# Altium project Board Gate Logic.PrjPcb
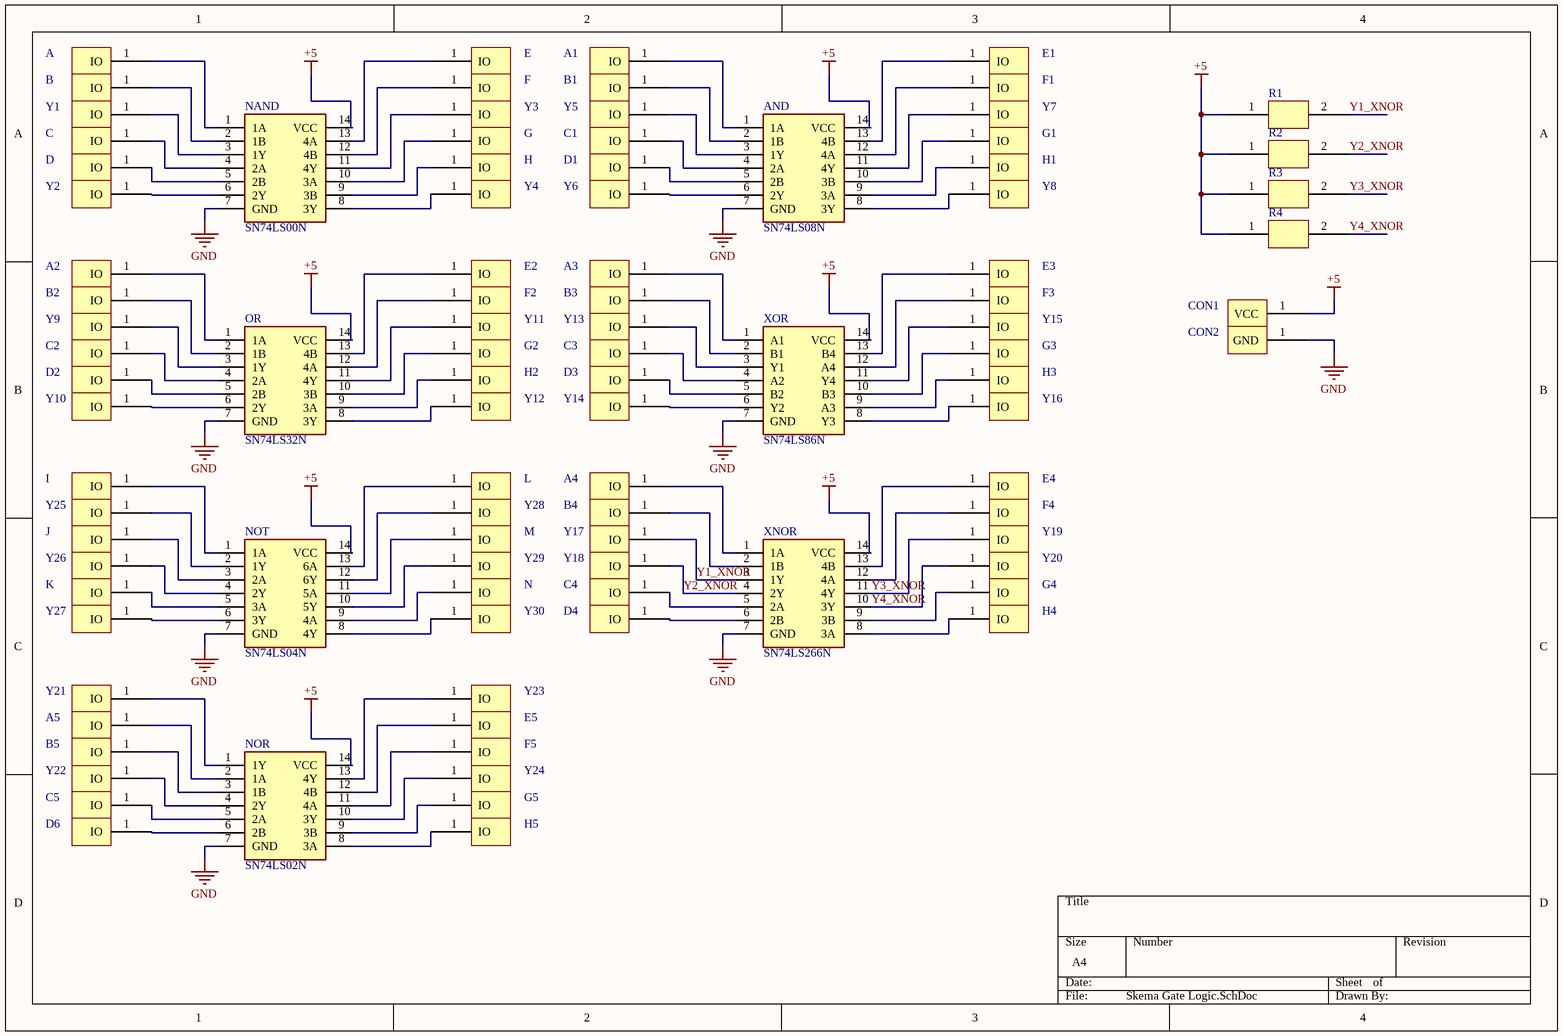
[diagram p0: Skema Gate Logic.SchDoc]
1 sheet, 97 parts. Net scope: global (net labels, ports and power ports of the same name join across sheets).
Board file: PCB Gate Logic.PcbDoc

## Sheet Skema Gate Logic.SchDoc
size A4

### Parts
A  Female_Connector_Banana  [F_Banana]  (value not drawn)
A1  Female_Connector_Banana  [F_Banana]  (value not drawn)
A2  Female_Connector_Banana  [F_Banana]  (value not drawn)
A3  Female_Connector_Banana  [F_Banana]  (value not drawn)
A4  Female_Connector_Banana  [F_Banana]  (value not drawn)
A5  Female_Connector_Banana  [F_Banana]  (value not drawn)
AND  SN74LS08N  [DIP794W53P254L1930H508Q14N]
B  Female_Connector_Banana  [F_Banana]  (value not drawn)
B1  Female_Connector_Banana  [F_Banana]  (value not drawn)
B2  Female_Connector_Banana  [F_Banana]  (value not drawn)
B3  Female_Connector_Banana  [F_Banana]  (value not drawn)
B4  Female_Connector_Banana  [F_Banana]  (value not drawn)
B5  Female_Connector_Banana  [F_Banana]  (value not drawn)
C  Female_Connector_Banana  [F_Banana]  (value not drawn)
C1  Female_Connector_Banana  [F_Banana]  (value not drawn)
C2  Female_Connector_Banana  [F_Banana]  (value not drawn)
C3  Female_Connector_Banana  [F_Banana]  (value not drawn)
C4  Female_Connector_Banana  [F_Banana]  (value not drawn)
C5  Female_Connector_Banana  [F_Banana]  (value not drawn)
CON1  Female_Connector_Banana  [F_Banana]  (value not drawn)
CON2  Female_Connector_Banana  [F_Banana]  (value not drawn)
D  Female_Connector_Banana  [F_Banana]  (value not drawn)
D1  Female_Connector_Banana  [F_Banana]  (value not drawn)
D2  Female_Connector_Banana  [F_Banana]  (value not drawn)
D3  Female_Connector_Banana  [F_Banana]  (value not drawn)
D4  Female_Connector_Banana  [F_Banana]  (value not drawn)
D6  Female_Connector_Banana  [F_Banana]  (value not drawn)
E  Female_Connector_Banana  [F_Banana]  (value not drawn)
E1  Female_Connector_Banana  [F_Banana]  (value not drawn)
E2  Female_Connector_Banana  [F_Banana]  (value not drawn)
E3  Female_Connector_Banana  [F_Banana]  (value not drawn)
E4  Female_Connector_Banana  [F_Banana]  (value not drawn)
E5  Female_Connector_Banana  [F_Banana]  (value not drawn)
F  Female_Connector_Banana  [F_Banana]  (value not drawn)
F1  Female_Connector_Banana  [F_Banana]  (value not drawn)
F2  Female_Connector_Banana  [F_Banana]  (value not drawn)
F3  Female_Connector_Banana  [F_Banana]  (value not drawn)
F4  Female_Connector_Banana  [F_Banana]  (value not drawn)
F5  Female_Connector_Banana  [F_Banana]  (value not drawn)
G  Female_Connector_Banana  [F_Banana]  (value not drawn)
G1  Female_Connector_Banana  [F_Banana]  (value not drawn)
G2  Female_Connector_Banana  [F_Banana]  (value not drawn)
G3  Female_Connector_Banana  [F_Banana]  (value not drawn)
G4  Female_Connector_Banana  [F_Banana]  (value not drawn)
G5  Female_Connector_Banana  [F_Banana]  (value not drawn)
H  Female_Connector_Banana  [F_Banana]  (value not drawn)
H1  Female_Connector_Banana  [F_Banana]  (value not drawn)
H2  Female_Connector_Banana  [F_Banana]  (value not drawn)
H3  Female_Connector_Banana  [F_Banana]  (value not drawn)
H4  Female_Connector_Banana  [F_Banana]  (value not drawn)
H5  Female_Connector_Banana  [F_Banana]  (value not drawn)
I  Female_Connector_Banana  [F_Banana]  (value not drawn)
J  Female_Connector_Banana  [F_Banana]  (value not drawn)
K  Female_Connector_Banana  [F_Banana]  (value not drawn)
L  Female_Connector_Banana  [F_Banana]  (value not drawn)
M  Female_Connector_Banana  [F_Banana]  (value not drawn)
N  Female_Connector_Banana  [F_Banana]  (value not drawn)
NAND  SN74LS00N  [DIP794W53P254L1930H508Q14N]
NOR  SN74LS02N  [DIP794W53P254L1930H508Q14N]
NOT  SN74LS04N  [DIP794W53P254L1930H508Q14N]
OR  SN74LS32N  [DIP794W53P254L1930H508Q14N]
R1  Resistor  [Resistor]  (value not drawn)
R2  Resistor  [Resistor]  (value not drawn)
R3  Resistor  [Resistor]  (value not drawn)
R4  Resistor  [Resistor]  (value not drawn)
XNOR  SN74LS266N  [DIP794W53P254L1930H508Q14N]
XOR  SN74LS86N  [DIP794W53P254L1930H508Q14N]
Y1  Female_Connector_Banana  [F_Banana]  (value not drawn)
Y2  Female_Connector_Banana  [F_Banana]  (value not drawn)
Y3  Female_Connector_Banana  [F_Banana]  (value not drawn)
Y4  Female_Connector_Banana  [F_Banana]  (value not drawn)
Y5  Female_Connector_Banana  [F_Banana]  (value not drawn)
Y6  Female_Connector_Banana  [F_Banana]  (value not drawn)
Y7  Female_Connector_Banana  [F_Banana]  (value not drawn)
Y8  Female_Connector_Banana  [F_Banana]  (value not drawn)
Y9  Female_Connector_Banana  [F_Banana]  (value not drawn)
Y10  Female_Connector_Banana  [F_Banana]  (value not drawn)
Y11  Female_Connector_Banana  [F_Banana]  (value not drawn)
Y12  Female_Connector_Banana  [F_Banana]  (value not drawn)
Y13  Female_Connector_Banana  [F_Banana]  (value not drawn)
Y14  Female_Connector_Banana  [F_Banana]  (value not drawn)
Y15  Female_Connector_Banana  [F_Banana]  (value not drawn)
Y16  Female_Connector_Banana  [F_Banana]  (value not drawn)
Y17  Female_Connector_Banana  [F_Banana]  (value not drawn)
Y18  Female_Connector_Banana  [F_Banana]  (value not drawn)
Y19  Female_Connector_Banana  [F_Banana]  (value not drawn)
Y20  Female_Connector_Banana  [F_Banana]  (value not drawn)
Y21  Female_Connector_Banana  [F_Banana]  (value not drawn)
Y22  Female_Connector_Banana  [F_Banana]  (value not drawn)
Y23  Female_Connector_Banana  [F_Banana]  (value not drawn)
Y24  Female_Connector_Banana  [F_Banana]  (value not drawn)
Y25  Female_Connector_Banana  [F_Banana]  (value not drawn)
Y26  Female_Connector_Banana  [F_Banana]  (value not drawn)
Y27  Female_Connector_Banana  [F_Banana]  (value not drawn)
Y28  Female_Connector_Banana  [F_Banana]  (value not drawn)
Y29  Female_Connector_Banana  [F_Banana]  (value not drawn)
Y30  Female_Connector_Banana  [F_Banana]  (value not drawn)

### Nets
+5: AND.14(VCC) CON1.1(VCC) NAND.14(VCC) NOR.14(VCC) NOT.14(VCC) OR.14(VCC) R1.1 R2.1 R3.1 R4.1 XNOR.14(VCC) XOR.14(VCC)
GND: AND.7(GND) CON2.1(GND) NAND.7(GND) NOR.7(GND) NOT.7(GND) OR.7(GND) XNOR.7(GND) XOR.7(GND)
Y1_XNOR: R1.2 XNOR.3(1Y) Y17.1(IO)
Y2_XNOR: R2.2 XNOR.4(2Y) Y18.1(IO)
Y3_XNOR: R3.2 XNOR.11(4Y) Y19.1(IO)
Y4_XNOR: R4.2 XNOR.10(3Y) Y20.1(IO)
NetA1_1: A1.1(IO) AND.1(1A)
NetA2_1: A2.1(IO) OR.1(1A)
NetA3_1: A3.1(IO) XOR.1(A1)
NetA4_1: A4.1(IO) XNOR.1(1A)
NetA5_1: A5.1(IO) NOR.2(1A)
NetA_1: A.1(IO) NAND.1(1A)
NetAND_2: AND.2(1B) B1.1(IO)
NetAND_3: AND.3(1Y) Y5.1(IO)
NetAND_4: AND.4(2A) C1.1(IO)
NetAND_5: AND.5(2B) D1.1(IO)
NetAND_6: AND.6(2Y) Y6.1(IO)
NetAND_8: AND.8(3Y) Y8.1(IO)
NetAND_9: AND.9(3A) H1.1(IO)
NetAND_10: AND.10(3B) G1.1(IO)
NetAND_11: AND.11(4Y) Y7.1(IO)
NetAND_12: AND.12(4A) F1.1(IO)
NetAND_13: AND.13(4B) E1.1(IO)
NetB2_1: B2.1(IO) OR.2(1B)
NetB3_1: B3.1(IO) XOR.2(B1)
NetB4_1: B4.1(IO) XNOR.2(1B)
NetB5_1: B5.1(IO) NOR.3(1B)
NetB_1: B.1(IO) NAND.2(1B)
NetC2_1: C2.1(IO) OR.4(2A)
NetC3_1: C3.1(IO) XOR.4(A2)
NetC4_1: C4.1(IO) XNOR.5(2A)
NetC5_1: C5.1(IO) NOR.5(2A)
NetC_1: C.1(IO) NAND.4(2A)
NetD2_1: D2.1(IO) OR.5(2B)
NetD3_1: D3.1(IO) XOR.5(B2)
NetD4_1: D4.1(IO) XNOR.6(2B)
NetD6_1: D6.1(IO) NOR.6(2B)
NetD_1: D.1(IO) NAND.5(2B)
NetE2_1: E2.1(IO) OR.13(4B)
NetE3_1: E3.1(IO) XOR.13(B4)
NetE4_1: E4.1(IO) XNOR.13(4B)
NetE5_1: E5.1(IO) NOR.12(4B)
NetE_1: E.1(IO) NAND.13(4A)
NetF2_1: F2.1(IO) OR.12(4A)
NetF3_1: F3.1(IO) XOR.12(A4)
NetF4_1: F4.1(IO) XNOR.12(4A)
NetF5_1: F5.1(IO) NOR.11(4A)
NetF_1: F.1(IO) NAND.12(4B)
NetG2_1: G2.1(IO) OR.10(3B)
NetG3_1: G3.1(IO) XOR.10(B3)
NetG4_1: G4.1(IO) XNOR.9(3B)
NetG5_1: G5.1(IO) NOR.9(3B)
NetG_1: G.1(IO) NAND.10(3A)
NetH2_1: H2.1(IO) OR.9(3A)
NetH3_1: H3.1(IO) XOR.9(A3)
NetH4_1: H4.1(IO) XNOR.8(3A)
NetH5_1: H5.1(IO) NOR.8(3A)
NetH_1: H.1(IO) NAND.9(3B)
NetI_1: I.1(IO) NOT.1(1A)
NetJ_1: J.1(IO) NOT.3(2A)
NetK_1: K.1(IO) NOT.5(3A)
NetL_1: L.1(IO) NOT.13(6A)
NetM_1: M.1(IO) NOT.11(5A)
NetN_1: N.1(IO) NOT.9(4A)
NetNAND_3: NAND.3(1Y) Y1.1(IO)
NetNAND_6: NAND.6(2Y) Y2.1(IO)
NetNAND_8: NAND.8(3Y) Y4.1(IO)
NetNAND_11: NAND.11(4Y) Y3.1(IO)
NetNOR_1: NOR.1(1Y) Y21.1(IO)
NetNOR_4: NOR.4(2Y) Y22.1(IO)
NetNOR_10: NOR.10(3Y) Y24.1(IO)
NetNOR_13: NOR.13(4Y) Y23.1(IO)
NetNOT_2: NOT.2(1Y) Y25.1(IO)
NetNOT_4: NOT.4(2Y) Y26.1(IO)
NetNOT_6: NOT.6(3Y) Y27.1(IO)
NetNOT_8: NOT.8(4Y) Y30.1(IO)
NetNOT_10: NOT.10(5Y) Y29.1(IO)
NetNOT_12: NOT.12(6Y) Y28.1(IO)
NetOR_3: OR.3(1Y) Y9.1(IO)
NetOR_6: OR.6(2Y) Y10.1(IO)
NetOR_8: OR.8(3Y) Y12.1(IO)
NetOR_11: OR.11(4Y) Y11.1(IO)
NetXOR_3: XOR.3(Y1) Y13.1(IO)
NetXOR_6: XOR.6(Y2) Y14.1(IO)
NetXOR_8: XOR.8(Y3) Y16.1(IO)
NetXOR_11: XOR.11(Y4) Y15.1(IO)

### Library data of the parts
AND = SN74LS08N: Integrated Circuit; Manufacturer_Name: Texas Instruments; Datasheet Link: http://componentsearchengine.com/Datasheets/3/SN74LS08N.pdf; Height: 5.08mm; Manufacturer_Part_Number: SN74LS08N; Arrow Part Number: SN74LS08N; Arrow Price/Stock: https://www.arrow.com/en/products/sn74ls08n/texas-instruments; Mouser Part Number: 595-SN74LS08N; Mouser Price/Stock: https://www.mouser.co.uk/ProductDetail/Texas-Instruments/SN74LS08N?qs=spW5eSrOWB4y5MjcKVGhlA%3D%3D
NAND = SN74LS00N: Integrated Circuit; Manufacturer_Name: Texas Instruments; Datasheet Link: http://www.ti.com/lit/gpn/sn74ls00; Height: 5.08mm; Manufacturer_Part_Number: SN74LS00N; Arrow Part Number: SN74LS00N; Arrow Price/Stock: https://www.arrow.com/en/products/sn74ls00n/texas-instruments; Mouser Part Number: 595-SN74LS00N; Mouser Price/Stock: https://www.mouser.co.uk/ProductDetail/Texas-Instruments/SN74LS00N?qs=spW5eSrOWB6G5wECF%252BEZFA%3D%3D
NOR = SN74LS02N: Integrated Circuit; Manufacturer_Name: Texas Instruments; Datasheet Link: http://www.ti.com/lit/gpn/sn74ls02; Manufacturer_Part_Number: SN74LS02N; Arrow Part Number: SN74LS02N; Arrow Price/Stock: https://www.arrow.com/en/products/sn74ls02n/texas-instruments; Mouser Part Number: 595-SN74LS02N; Mouser Price/Stock: https://www.mouser.co.uk/ProductDetail/Texas-Instruments/SN74LS02N?qs=spW5eSrOWB4KM%252BpAgRke5g%3D%3D; Height: 5.08mm
NOT = SN74LS04N: Integrated Circuit; Manufacturer_Name: Texas Instruments; Datasheet Link: http://www.ti.com/lit/gpn/sn74ls04; Height: 5.08mm; Manufacturer_Part_Number: SN74LS04N; Arrow Part Number: SN74LS04N; Arrow Price/Stock: https://www.arrow.com/en/products/sn74ls04n/texas-instruments; Mouser Part Number: 595-SN74LS04N; Mouser Price/Stock: https://www.mouser.co.uk/ProductDetail/Texas-Instruments/SN74LS04N?qs=spW5eSrOWB4DgGWIHPxzvg%3D%3D
OR = SN74LS32N: Integrated Circuit; Manufacturer_Name: Texas Instruments; Datasheet Link: http://componentsearchengine.com/Datasheets/3/SN74LS32N.pdf; Height: 5.08mm; Manufacturer_Part_Number: SN74LS32N; Arrow Part Number: SN74LS32N; Arrow Price/Stock: https://www.arrow.com/en/products/sn74ls32n/texas-instruments; Mouser Part Number: 595-SN74LS32N; Mouser Price/Stock: https://www.mouser.co.uk/ProductDetail/Texas-Instruments/SN74LS32N?qs=q2XTDbzbm6DA9Mnew5GiLA%3D%3D
R1-R4 = Resistor: Fixed Resistance
XNOR = SN74LS266N: Integrated Circuit; Manufacturer_Name: Texas Instruments; Datasheet Link: http://www.ti.com/lit/gpn/sn74ls266; Manufacturer_Part_Number: SN74LS266N; Arrow Part Number: SN74LS266N; Arrow Price/Stock: https://www.arrow.com/en/products/sn74ls266n/texas-instruments; Mouser Part Number: 595-SN74LS266N; Mouser Price/Stock: https://www.mouser.co.uk/ProductDetail/Texas-Instruments/SN74LS266N?qs=JD1fk4stihabbJk2g9oIRA%3D%3D
XOR = SN74LS86N: Integrated Circuit; Manufacturer_Name: ON Semiconductor; Datasheet Link: https://docs-emea.rs-online.com/webdocs/0029/0900766b800296c4.pdf; Height: 4.69mm; Manufacturer_Part_Number: SN74LS86N